# EAGLE design esprelayboard (EAGLE 9.6.2)
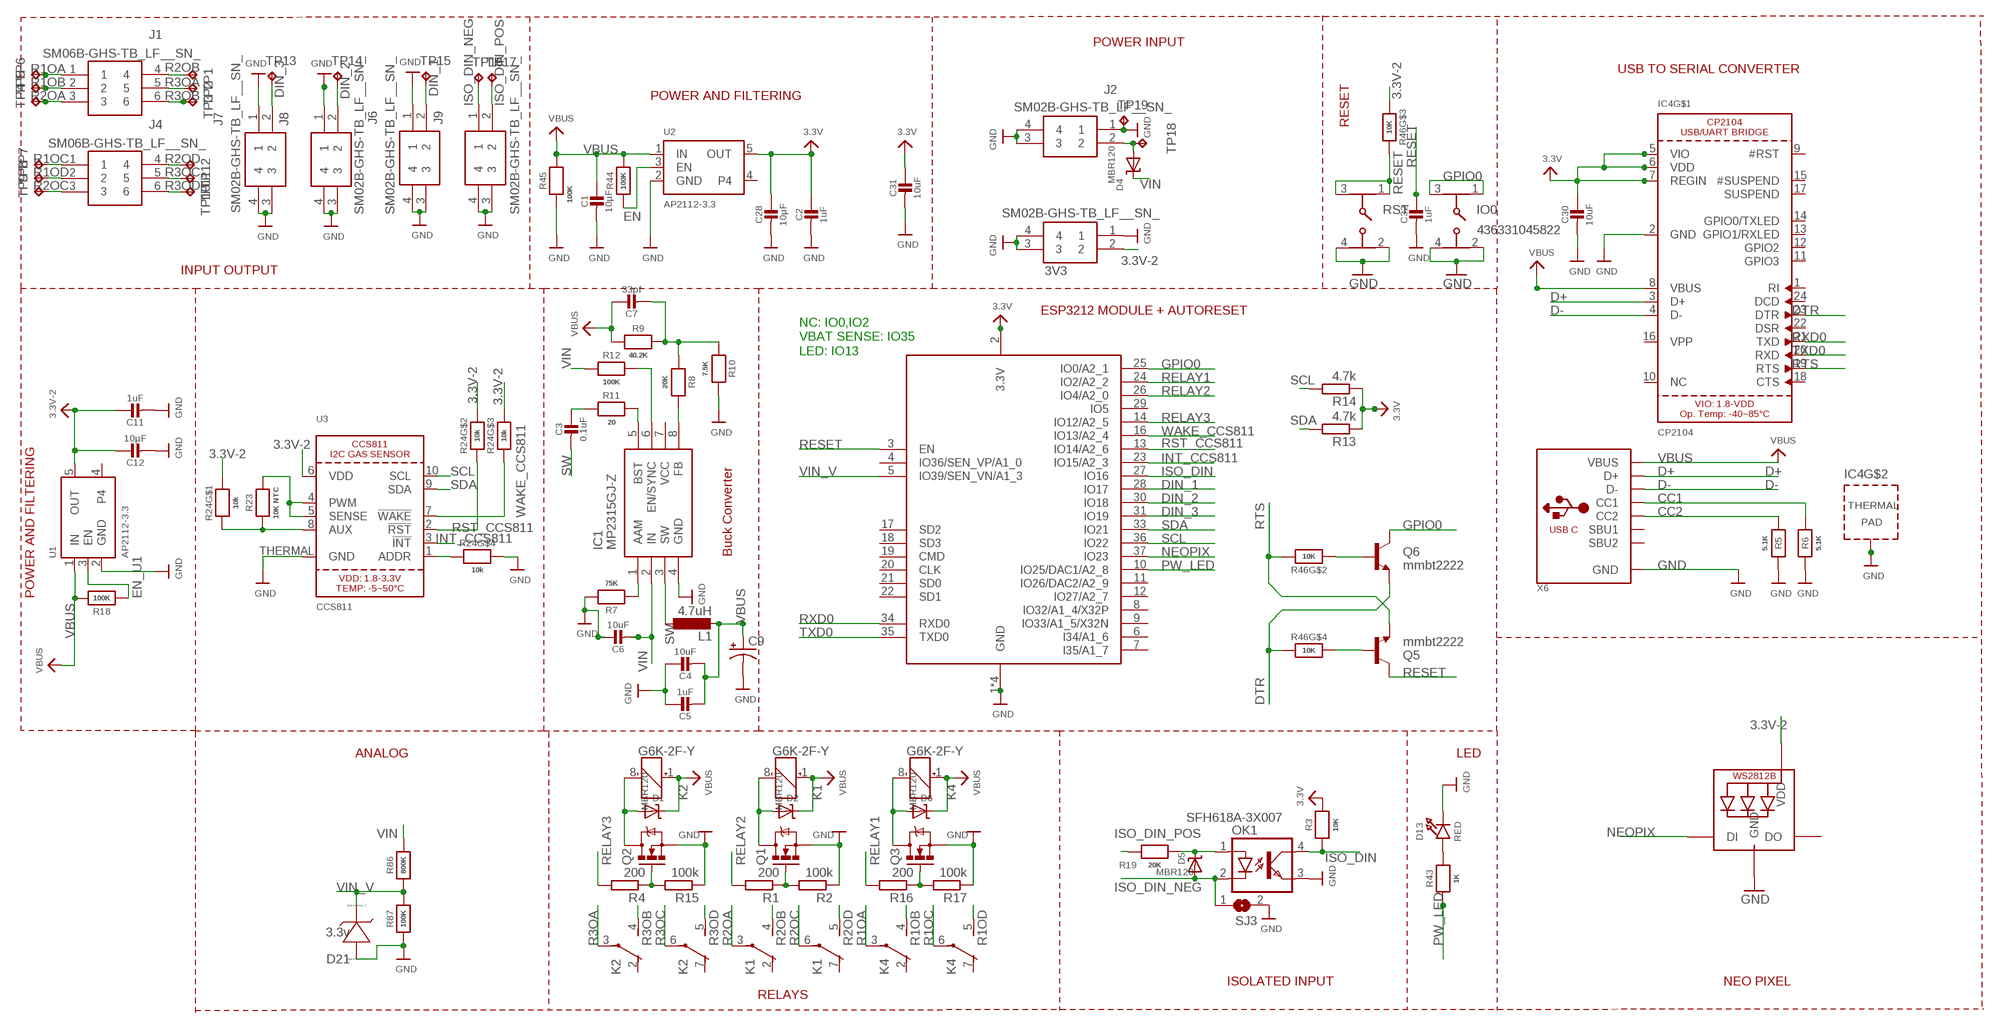
[diagram p0: schematic, sheet 1]

## Parts
3V3  SM02B-GHS-TB_LF__SN_  [SM02BGHSTBLFSN]
C1  10µF  CAP_CERAMIC0805-NOOUTLINE  [0805-NO]
C2  1uF  CAP_CERAMIC0603_NO  [0603-NO@1]
C3  0.1uF  CAP_CERAMIC0603_NO  [0603-NO@1]
C4  10uF  CAP_CERAMIC0603_NO  [0603-NO@1]
C5  1uF  CAP_CERAMIC0603_NO  [0603-NO@1]
C6  10uF  CAP_CERAMIC0603_NO  [0603-NO@1]
C7  33pf  CAP_CERAMIC0603_NO  [0603-NO@1]
C9  CPOL-USUD-6,3X5,8  [UD-6,3X5,8_NICHICON]
C11  1uF  CAP_CERAMIC0603_NO  [0603-NO@1]
C12  10µF  CAP_CERAMIC0805-NOOUTLINE  [0805-NO]
C28  10µF  CAP_CERAMIC0805-NOOUTLINE  [0805-NO]
C30  10uF  CAP_CERAMIC0805-NOOUTLINE  [0805-NO]
C31  10uF  CAP_CERAMIC0805-NOOUTLINE  [0805-NO]
C32  1uF  CAP_CERAMIC0603_NO  [0603-NO@1]
D1  MBR120  DIODE-SCHOTTKYSOD-123  [SOD-123]
D2  MBR120  DIODE-SCHOTTKYSOD-123  [SOD-123]
D4  MBR120  DIODE-SCHOTTKYSOD-123  [SOD-123]
D5  MBR120  DIODE-SCHOTTKYSOD-123  [SOD-123]
D6  MBR120  DIODE-SCHOTTKYSOD-123  [SOD-123]
D13  RED  LED0805_NOOUTLINE  [CHIPLED_0805_NOOUTLINE]
D21  3.3v  ZENER  [SOD123]
IC1  MP2315GJ-Z  [SOT65P280X100-8N]
IC4  CP2104  [QFN24_4MM_SMSC]
IO0  436331045822  [436331045822]
J1  SM06B-GHS-TB_LF__SN_  [SM06B-GHS-TB]
J2  SM02B-GHS-TB_LF__SN_  [SM02BGHSTBLFSN]
J4  SM06B-GHS-TB_LF__SN_  [SM06B-GHS-TB]
J6  SM02B-GHS-TB_LF__SN_  [SM02BGHSTBLFSN]
J7  SM02B-GHS-TB_LF__SN_  [SM02BGHSTBLFSN]
J8  SM02B-GHS-TB_LF__SN_  [SM02BGHSTBLFSN]
J9  SM02B-GHS-TB_LF__SN_  [SM02BGHSTBLFSN]
K1  G6K-2F-Y  [G6K-2F-Y]
K2  G6K-2F-Y  [G6K-2F-Y]
K4  G6K-2F-Y  [G6K-2F-Y]
L1  4.7uH  L-EUL2825P  [L2825P]
LED1  WS2812B3535  [LED3535]
OK1  SFH618A-3X007  [SMD4-7]
Q1  MOSFET-NCHANNELAO3404A  [SOT23-3]
Q2  MOSFET-NCHANNELAO3404A  [SOT23-3]
Q3  MOSFET-NCHANNELAO3404A  [SOT23-3]
Q5  mmbt2222  TRANSISTOR_NPNSOT23-3  [SOT23-3]
Q6  mmbt2222  TRANSISTOR_NPNSOT23-3  [SOT23-3]
R1  200  R-EU_R0603  [R0603]
R2  100k  R-EU_R0603  [R0603]
R3  10K  RESISTOR_0603_NOOUT  [0603-NO]
R4  200  R-EU_R0603  [R0603]
R5  5.1K  RESISTOR_0603_NOOUT  [0603-NO]
R6  5.1K  RESISTOR_0603_NOOUT  [0603-NO]
R7  75K  RESISTOR_0603_NOOUT  [0603-NO]
R8  20K  RESISTOR_0603_NOOUT  [0603-NO]
R9  40.2K  RESISTOR_0603_NOOUT  [0603-NO]
R10  7.5K  RESISTOR_0603_NOOUT  [0603-NO]
R11  20  RESISTOR_0603_NOOUT  [0603-NO]
R12  100K  RESISTOR_0603_NOOUT  [0603-NO]
R13  4.7k  R-EU_R0603  [R0603]
R14  4.7k  R-EU_R0603  [R0603]
R15  100k  R-EU_R0603  [R0603]
R16  200  R-EU_R0603  [R0603]
R17  100k  R-EU_R0603  [R0603]
R18  100K  RESISTOR_0603_NOOUT  [0603-NO]
R19  20K  RESISTOR_0603_NOOUT  [0603-NO]
R23  10K NTC  RESISTOR_0402  [_0402]
R24  10k  RESISTOR_4PACK  [RESPACK_4X0603]
R43  1K  RESISTOR_0603_NOOUT  [0603-NO]
R44  100K  RESISTOR_0603_NOOUT  [0603-NO]
R45  100K  RESISTOR_0603_NOOUT  [0603-NO]
R46  10K  RESISTOR_4PACK  [RESPACK_4X0603]
R86  800K  RESISTOR_0603_NOOUT  [0603-NO]
R87  100K  RESISTOR_0603_NOOUT  [0603-NO]
RST  436331045822  [436331045822]
SJ3  SJ  [SJ]
TP1  TPTP14SQ  [TP14SQ]
TP2  TPTP14SQ  [TP14SQ]
TP3  TPTP14SQ  [TP14SQ]
TP4  TPTP14SQ  [TP14SQ]
TP5  TPTP14SQ  [TP14SQ]
TP6  TPTP14SQ  [TP14SQ]
TP7  TPTP14SQ  [TP14SQ]
TP8  TPTP14SQ  [TP14SQ]
TP9  TPTP14SQ  [TP14SQ]
TP10  TPTP14SQ  [TP14SQ]
TP11  TPTP14SQ  [TP14SQ]
TP12  TPTP14SQ  [TP14SQ]
TP13  TPTP14SQ  [TP14SQ]
TP14  TPTP14SQ  [TP14SQ]
TP15  TPTP14SQ  [TP14SQ]
TP16  TPTP14SQ  [TP14SQ]
TP17  TPTP14SQ  [TP14SQ]
TP18  TPTP14SQ  [TP14SQ]
TP19  TPTP14SQ  [TP14SQ]
U1  AP2112-3.3  VREG_SOT23-5  [SOT23-5]
U2  AP2112-3.3  VREG_SOT23-5  [SOT23-5]
U3  CCS811  [CCS811]
X6  USB_C  [USB_C_CUSB31-CFM2AX-01-X]
X8  ESP32_WROOM32_SKINNY  [WROOM32_SKINNY]

## Nets
3.3V: C2.1 C28.1 C31.1 R3.1 R13.1 R14.1 U2.5(OUT) X8.2(3.3V)
3.3V-2: 3V3.2 C11.1 C12.1 C30.1 IC4.5(VIO) IC4.6(VDD) IC4.7(REGIN) LED1.2(VDD) R24.6 R24.7 R24.8 R46.3 U1.5(OUT) U3.6(VDD) ; supply symbol labelled 3.3V
CC1: R6.2 X6.A5(CC1)
CC2: R5.2 X6.B5(CC2)
D+: IC4.3(D+) X6.A6(D+) X6.B6(D+)
D-: IC4.4(D-) X6.A7(D-) X6.B7(D-)
DIN_1: J6.2 TP15.TP X8.28(IO17)
DIN_2: J8.2 TP14.TP X8.30(IO18)
DIN_3: J7.2 TP13.TP X8.31(IO19)
DTR: IC4.23(DTR) Q6.2(E) R46.4
EN: R44.1 U2.3(EN)
EN_U1: R18.1 U1.3(EN)
GND: 3V3.1 3V3.3 3V3.4 C1.2 C2.2 C4.1 C5.1 C6.1 C9.- C11.2 C12.2 C28.2 C30.2 C31.2 C32.2 D13.C D21.A(+) IC1.4(GND) IC4.2(GND) IC4.THERM(TP) IO0.2 IO0.4 J2.1 J2.3 J2.4 J6.1 J6.3 J6.4 J7.1 J7.3 J7.4 J8.1 J8.3 J8.4 J9.3 J9.4 LED1.4(GND) OK1.3(EMIT) Q1.2(S) Q2.2(S) Q3.2(S) R2.1 R5.1 R6.1 R7.2 R10.2 R15.1 R17.1 R24.5 R45.1 R87.1 RST.2 RST.4 SJ3.2 TP19.TP U1.2(GND) U2.2(GND) U3.THERMAL(GND) X6.A1B12(GND) X6.B1A12(GND) X8.1(GND) X8.15(GND) X8.38(GND) X8.P$1(GND)
GPIO0: IO0.1 IO0.3 Q6.3(C) X8.25(IO0/A2_1)
INT_CCS811: U3.3(!INT) X8.23(IO15/A2_3)
ISO_DIN: OK1.4(COL) R3.2 X8.27(IO16)
ISO_DIN_NEG [high_v]: D5.A J9.1 OK1.2(C) SJ3.1 TP16.TP
ISO_DIN_POS [high_v]: J9.2 R19.2 TP17.TP
N$1: D13.A R43.2
N$2: Q1.1(G) R1.1 R2.2
N$3: D2.A K1.8(1:-) Q1.3(D)
N$4: D4.A J2.2 TP18.TP
N$5: Q2.1(G) R4.1 R15.2
N$6: Q3.1(G) R16.1 R17.2
N$7: D1.A K2.8(1:-) Q2.3(D)
N$8: D6.A K4.8(1:-) Q3.3(D)
N$9 [high_v]: D5.C OK1.1(A) R19.1
N$13: R23.2 U3.4(PWM) U3.5(SENSE)
N$14: R23.1 R24.1 U3.8(AUX)
N$15: R24.4 U3.1(ADDR)
N$20: IC1.8(FB) R8.2
N$21: C7.2 R8.1 R9.2 R10.1
N$22: IC1.5(BST) R11.2
N$23: IC1.1(AAM) R7.1
N$24: IC1.6(EN/SYNC) R12.2
N$25: C3.1 R11.1
N$45: Q5.1(B) R46.5
N$48: Q6.1(B) R46.2
NEOPIX: LED1.1(DI) X8.37(IO23)
PW_LED: R43.1 X8.10(IO25/DAC1/A2_8)
R1OA: J1.1 K4.3(2:P) TP6.TP
R1OB: J1.2 K4.4(2:S) TP5.TP
R1OC: J4.1 K4.6(3:P) TP7.TP
R1OD: J4.2 K4.5(3:S) TP8.TP
R2OA: J1.3 K1.3(2:P) TP4.TP
R2OB: J1.4 K1.4(2:S) TP1.TP
R2OC: J4.3 K1.6(3:P) TP9.TP
R2OD: J4.4 K1.5(3:S) TP12.TP
R3OA: J1.5 K2.3(2:P) TP2.TP
R3OB: J1.6 K2.4(2:S) TP3.TP
R3OC: J4.5 K2.6(3:P) TP11.TP
R3OD: J4.6 K2.5(3:S) TP10.TP
RELAY1: R16.2 X8.24(IO2/A2_2)
RELAY2: R1.2 X8.26(IO4/A2_0)
RELAY3: R4.2 X8.14(IO12/A2_5)
RESET: C32.1 Q5.3(C) R46.6 RST.1 RST.3 X8.3(EN)
RST_CCS811: R24.2 U3.2(!RST) X8.13(IO14/A2_6)
RTS: IC4.19(RTS) Q5.2(E) R46.7
RXD0: IC4.21(TXD) X8.34(RXD0)
SCL: R14.2 U3.10(SCL) X8.36(IO22)
SDA: R13.2 U3.9(SDA) X8.33(IO21)
SW: C3.2 IC1.3(SW) L1.1
TXD0: IC4.20(RXD) X8.35(TXD0)
VBUS: C1.1 C4.2 C5.2 C7.1 C9.+ D1.C D2.C D6.C IC4.8(VBUS) K1.1(1:+) K2.1(1:+) K4.1(1:+) L1.2 R9.1 R18.2 R44.2 R45.2 U1.1(IN) U2.1(IN) X6.A4B9(VBUS) X6.B4A9(VBUS)
VIN: C6.2 D4.C IC1.2(IN) R12.1 R86.2
VIN_V: D21.C(-) R86.1 R87.2 X8.5(IO39/SEN_VN/A1_3)
WAKE_CCS811: R24.3 U3.7(!WAKE) X8.16(IO13/A2_4)
Unconnected: IC1.7(VCC) IC4.1(RI) IC4.9(#RST) IC4.10(NC) IC4.11(GPIO3) IC4.12(GPIO2) IC4.13(GPIO1/RXLED) IC4.14(GPIO0/TXLED) IC4.15(#SUSPEND) IC4.16(VPP) IC4.17(SUSPEND) IC4.18(CTS) IC4.22(DSR) IC4.24(DCD) K1.2(2:O) K1.7(3:O) K2.2(2:O) K2.7(3:O) K4.2(2:O) K4.7(3:O) LED1.3(DO) R46.1 R46.8 U1.4 U2.4 X6.A8(SBU1) X6.B8(SBU2) X8.4(IO36/SEN_VP/A1_0) X8.6(I34/A1_6) X8.7(I35/A1_7) X8.8(IO32/A1_4/X32P) X8.9(IO33/A1_5/X32N) X8.11(IO26/DAC2/A2_9) X8.12(IO27/A2_7) X8.17(SD2) X8.18(SD3) X8.19(CMD) X8.20(CLK) X8.21(SD0) X8.22(SD1) X8.29(IO5)

## Notes on the sheet
- POWER INPUT
- USB TO SERIAL CONVERTER
- POWER AND FILTERING
- RESET
- INPUT OUTPUT
- ESP3212 MODULE + AUTORESET
- NC: IO0,IO2
  VBAT SENSE: IO35
  LED: IO13
- Buck Converter
- POWER AND FILTERING
- ANALOG | LED
- ISOLATED INPUT | NEO PIXEL
- RELAYS

## Library data of the parts
3V3 J2 J6-J9 = SM02B-GHS-TB_LF__SN_:SM02B-GHS-TB_LF__SN_: GH 1.25mm header side entry 2 way JST GH Series, 1.25mm Pitch 2 Way Shrouded Right Angle PCB Header, Surface Mount, Solder Termination Source: Datasheet <http://docs-emea.rs-online.com/webdocs/13ed/0900766b813ed075.pdf>; ARROW_PART_NUMBER: SM02B-GHS-TB(LF)(SN); ARROW_PRICE-STOCK: https://www.arrow.com/en/products/sm02b-ghs-tb-lf-sn/jst-manufacturing; DESCRIPTION: GH 1.25mm header side entry 2 way JST GH Series, 1.25mm Pitch 2 Way Shrouded Right Angle PCB Header, Surface Mount, Solder Termination; HEIGHT: 4.25mm; MANUFACTURER_NAME: JST (JAPAN SOLDERLESS TERMINALS); MANUFACTURER_PART_NUMBER: SM02B-GHS-TB(LF)(SN)
C1-C7 C11 C12 C28 C30-C32 = microbuilder:CAP_CERAMIC: Ceramic Capacitors For new designs, use the packages preceded by an '_' character since they are more reliable: The following footprints should be used on most boards: _0402 - Standard footprint for regular board layouts _0603 - Standard footprint for regular board layouts _0805 - Standard footprint for regular board layouts _1206 - Standard footprint for regular board layouts For extremely tight-pitch boards where space is at a premium, the following 'micro-pitch' footprints can be used (smaller pads, no silkscreen outline, etc.): _0402MP - Micro-pitch footprint for very dense/compact boards _0603MP - Micro-pitch footprint for very dense/compact boards _0805MP - Micro-pitch footprint for very dense/compact boards _1206MP - Micro-pitch footprint for very dense/compact boards
C9 = rcl:CPOL-US: POLARIZED CAPACITOR, American symbol; SPICEPREFIX: C
D1 D2 D4-D6 = microbuilder:DIODE-SCHOTTKY
D13 = microbuilder:LED: LED 0603 - 0603 Surface Mount Package 2mA: Green LED - Low Power (3.9mcd, 2ma, 1.7Vf) - Digikey: 475-2709-2-ND Orange LED - Low Power (9.8mcd, 2ma, 1.8Vf) - Digikey: 475-1194-2-ND Red LED - Low Power (5mcd, 2ma, 1.8Vf) - Digikey: 475-1195-2-ND Yellow LED - Low Power (7mcd, 2ma, 1.8Vf) - Digikey: 475-1196-2-ND 5mA: Blue LED - Low Power (17mcd, 5ma, 2.9Vf) - Digikey: LNJ937W8CRACT-ND 0805 - 0805 Surface Mount Package 2mA: Red LED (8.8mcd, 2mA, 1.8Vf, Clear) - Low Power [Digikey: 475-2510-1-ND] Green LED (5mcd, 2mA, 1.8Vf, Clear) - Low Power [Digikey: 475-2730-1-ND] Yellow LED (11.3mcd, 2mA, 1.8Vf, Clear) - Low Power [Digikey: 475-2555-1-ND] 20mA: Red LED (104mcd, 20mA, Diffused) - LS R976 [Digikey: 475-1278-6-ND] Red LED (12mcd, 20mA, 2.0Vf, Clear) - APT2012EC [Digikey: 754-1128-1-ND] Green LED (15mcd, 20mA, 2.2Vf, Clear) - APT2012GC [Digikey: 754-1131-1-ND] Orange LED (160mcd, 20mA, 2.1Vf, Clear) - APT2012SECK [Digikey: 754-1130-1-ND] 1206 - 1206 Surface Mount Package Green LED (26mcd, 20mA, Diffused) - LG N971 [Digikey: 475-1407-6-ND] Red LED (15mcd, 20mA, Diffused) - LH N974 [Digikey: 475-1416-6-ND] Cree - Cree High-Power Surface Mount LEDs XPEBWT-L1-0000-00D50 - White 111lm 350mA 2.9Vf 6200K 110° XTEAWT-00-0000-00000LEE3 - White 114lm 350mA 2.85Vf 5000K 115° Everlight - Everlight 45-21 Series Surface Mount LEDs 45-21/QK2C-B2832AC2CB2/2T - Warm White 2000mcd 20mA 3.25Vf 3050K 120° 45-21/LK2C-B38452C4CB2/2T - Nuetral White 2000mcd 20mA 3.25Vf 4150K 120° 45-21/LK2C-B50634C6CB2/2T - Cold White 2200mcd 20mA 3.25Vf 5650K 120° PLCC2 Reverse Mount LS T77K-J1L2-1-0-2-R18-Z - Red 11.25mcd 2mA 1.8Vf 630nm 120° LO T77K-L1M2-24-Z - Orange 19.6mcd 2mA 1.8Vf 606nm 120° LY T77K-K2M1-26-Z - Yellow 15.7mcd 2mA 1.8Vf 587nm 120°
D21 = sym:ZENER: Zener Diode
IC1 = MP2315GJ-Z:MP2315GJ-Z: Switching Voltage Regulators 3A 24V 500kHz Sync buck Source: Datasheet <https://componentsearchengine.com/Datasheets/1/MP2315GJ-Z.pdf>; DESCRIPTION: Switching Voltage Regulators 3A 24V 500kHz Sync buck; HEIGHT: 1mm; MANUFACTURER_NAME: Monolithic Power Systems (MPS); MANUFACTURER_PART_NUMBER: MP2315GJ-Z; MOUSER_PART_NUMBER: 946-MP2315GJZ; MOUSER_PRICE-STOCK: https://www.mouser.co.uk/ProductDetail/Monolithic-Power-Systems-MPS/MP2315GJ-Z?qs=QEkzKklKf2QEN5VKd%252Br2GQ%3D%3D
IC4 = microbuilder:CP2104: CP2104 - USB to UART Bridge VDD Output: 3.45V
IO0 RST = 436331045822:436331045822: 3.5x4.7 mm SMD J-Bend side push, boss design WS-TASU <http://katalog.we-online.de/media/images/v2/Family_WS_TUS_Normal_SMD_J-Bend_4363x10458xx_pf2.jpg> Details see: http://katalog.we-online.de/em/datasheet/4363x10458xx.pdf 2015 (C) Wurth Elektronik; AVAILABILITY: Unavailable; DESCRIPTION: Tactile Switch SPST-NO Side Actuated Surface Mount, Right Angle; DIGIKEY-PURCHASE-URL: https://snapeda.com/shop?store=DigiKey&id=3209049; MF: Wurth Electronics; MOUSER-PURCHASE-URL: https://snapeda.com/shop?store=Mouser&id=3209049; MP: 436331045822; PACKAGE: None; PRICE: None
J1 J4 = SM06B-GHS-TB_LF__SN_:SM06B-GHS-TB_LF__SN_: GH 1.25mm header side entry 6 way JST GH Series, 1.25mm Pitch 6 Way Right Angle PCB Header, Solder Termination, 1A Source: Datasheet <http://docs-emea.rs-online.com/webdocs/13ed/0900766b813ed077.pdf>; ARROW_PART_NUMBER: SM06B-GHS-TB(LF)(SN); ARROW_PRICE-STOCK: https://www.arrow.com/en/products/sm06b-ghs-tb-lf-sn/jst-manufacturing; DESCRIPTION: GH 1.25mm header side entry 6 way JST GH Series, 1.25mm Pitch 6 Way Right Angle PCB Header, Solder Termination, 1A; HEIGHT: mm; MANUFACTURER_NAME: JST (JAPAN SOLDERLESS TERMINALS); MANUFACTURER_PART_NUMBER: SM06B-GHS-TB(LF)(SN)
K1 K2 K4 = relay:G6K: Low Signal Relay oeiwcsnts1.omron.com/.. D20G6K0100.pdf; MF: OMRON COMPONENTS USA; MPN: G6K-2F-Y DC3; OC_FARNELL: 1690316; OC_NEWARK: 89C6451
L1 = rcl:L-EU: INDUCTOR, European symbol; SPICEPREFIX: L
LED1 = microbuilder:WS2812B
OK1 = optocoupler:SFH618?*: Optocoupler, Phototransistor Output, Low Input Current Source: Data sheet <http://www.vishay.com/docs/83673/sfh618.pdf>; OC_FARNELL: unknown; OC_NEWARK: unknown
Q1-Q3 = SparkFun-DiscreteSemi:MOSFET-NCHANNEL: Common NMOSFET Parts MFG P/N Store ID Prod ID FDD8780 TRANS-09984 SI7820DN TRANS-11055 FDS6630A IC-08089 2N7002PW TRANS-11151 FQP30N06L COM-10213 TRANS-10060 BSS123LT1G TRANS-08345 BSS138 TRANS-00830 BS170 2N7000; PROD_ID: TRAN-12988
Q5 Q6 = SparkFun:TRANSISTOR_NPN: Transistor NPN BJT configuration in SOT23 package. MMBT2222 is the common NPN we use. Double check BCE configuration again layout.
R1 R2 R4 R13-R17 = resistor:R-EU_: RESISTOR, European symbol
R3 R5-R12 R18 R19 R23 R43-R45 R86 R87 = microbuilder:RESISTOR: Resistors For new designs, use the packages preceded by an '_' character since they are more reliable: The following footprints should be used on most boards: _0402 - Standard footprint for regular board layouts _0603 - Standard footprint for regular board layouts _0805 - Standard footprint for regular board layouts _1206 - Standard footprint for regular board layouts For extremely tight-pitch boards where space is at a premium, the following 'micro-pitch' footprints can be used (smaller pads, no silkscreen outline, etc.): _0402MP - Micro-pitch footprint for very dense/compact boards _0603MP - Micro-pitch footprint for very dense/compact boards _0805MP - Micro-pitch footprint for very dense/compact boards _1206MP - Micro-pitch footprint for very dense/compact boards
R24 R46 = microbuilder:RESISTOR_4PACK: Resistor Packs (4 resistors) 4 x 0603 10K 1/16W - Digikey: YC164J-10KCT-ND
SJ3 = jumper:SJ: SMD solder JUMPER
TP1-TP19 = testpad:TP: Test pad
U1 U2 = microbuilder:VREG_SOT23-5: SOT23-5 Fixed Voltage Regulators Part Current Out V Out V In V Dropout θJA (°C/W) TJ (°C) Digikey Part No. ADP121 150mA 3.3V 3.4-5.5V 0.09V @ 150mA -- -- ADP121-AUJZ33R7CT-ND ADP121 150mA 3.0V 3.1-5.5V 0.09V @ 150mA -- -- ADP121-AUJZ30R7CT-ND ADP122 300mA 3.3V 3.4-5.5V 0.085V @ 300mA -- -- ADP122AUJZ-3.3-R7CT-ND ADP1712 300mA 3.3V 3.5-5.5V 0.17V @ 300mA -- -- ADP1712AUJZ-3.3-R7TR-ND AP7311 (Low Cost) 150mA 3.3V 3.5-6V 0.15V @ 150mA -- -- AP7311-33WG-7DICT-ND LD39015M18R 150mA 1.8V 1.9V-5.5V 0.08V @ 100mA -- -- 497-6977-1-ND LP2985A-33DBVR 150mA 3.3V 3.3-16V 0.28V @ 150mA 206 150 296-18479-1-ND MCP1824T-3302E/OT 300mA 3.3V 3.5V-6V 0.2V @ 300mA -- -- MCP1824T-3302E/OTCT-ND MIC5205-2.5YM5 TR 150mA 2.5V 2.7-16V 0.165V @ 150mA -- -- 576-1257-2-ND MIC5205-3.0YM5 TR 150mA 3.0V 3.2V-16V 0.165V @ 150mA -- -- 576-1258-2-ND MIC5205-3.3YM5 TR 150mA 3.3V 3.5V-16V 0.165V @ 150mA -- -- 576-1259-2-ND TPS780330220 150mA 3.3V+2.2V 3.6-5.5V 250mV Max -- -- 296-23332-1-ND TDA3663/N1,135 100mA 3.3V 3.5-45V 0.18V @ 50mA -- -- 568-5343-1-ND Max operating temp can be calculated using θJA, TJ (max junction temperature), and power in watts. Set the "Maximum Ambient Temperature" until it reaches TJ ("Max Junction Temperature"), which is the absolute limit for safe use of the regulator: Heat Sink Temperature Calculator <http://www.daycounter.com/Calculators/Heat-Sink-Temperature-Calculator.phtml> For example, With 12V source into a 3.3V LP2985 and a 30mA load, we are dissipating (12V-3.3V) * 0.03A = 0.261W. With a θJA of 206 °C/W, a TJ of 150°C, and 261mW we can safely use the chip without a heat sink up to 75°C (=147.1°C Junction Temperature).
U3 = microbuilder:CCS811: CCS811 - I2C Gas and Air Quality Sensor
X6 = microbuilder:USB_C: USB Type-C USB 2.0 Connector
X8 = microbuilder:ESP32_WROOM32

## Net classes
1 power: width 0.305 mm
2 gnd: width 0.254 mm, clearance 0.203 mm
3 high_v: clearance 0.254 mm

## Board
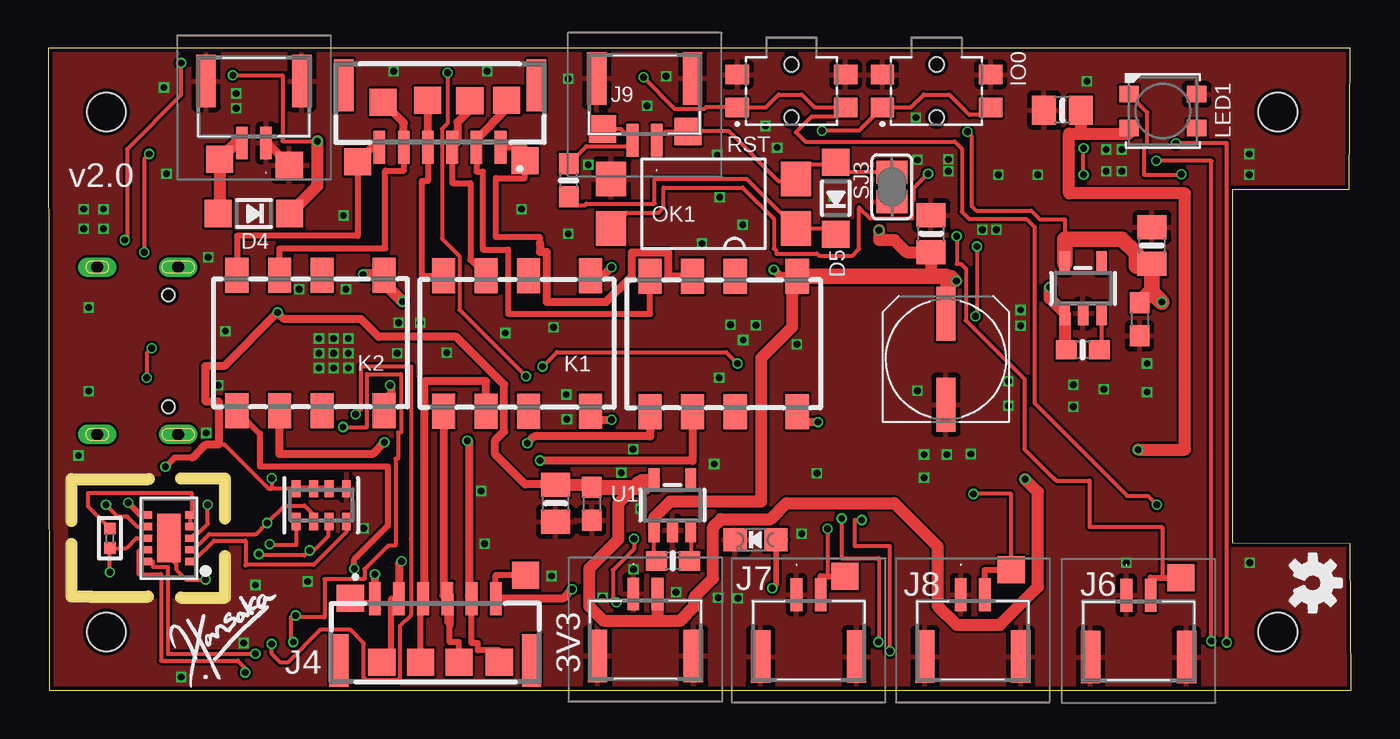
[diagram p1: board, top side]
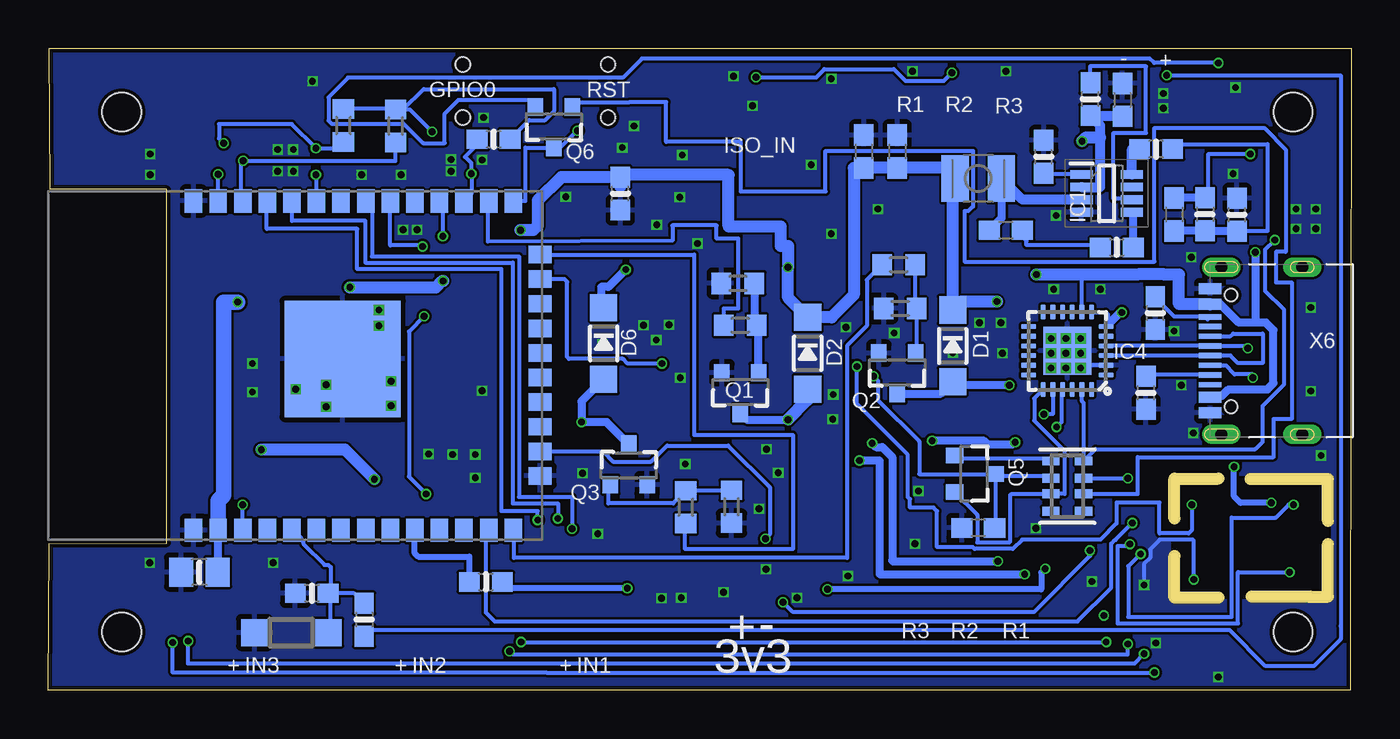
[diagram p2: board, bottom side, seen from below]

Size 67.28 x 33.14 mm. Coordinates in mm from the lower left corner, seen from the top.
Outline: 0.05,0 67.29,0 67.23,7.57 61.16,7.59 61.16,25.86 67.18,25.86 67.23,33.14 0,33.14 0.05,0
Copper layers (1*16): Top 0.035559375mm / dielectric 1.6mm / Bottom 0.035559375mm
Design rules "jlcpcb2layer": minimum track width 5mil, minimum drill 12mil, track to track 5mil, track to pad 5mil, pad to pad 5mil, via to via 5mil, smd to smd 5mil, copper to edge 8mil, drill to drill 6mil, minimum pad ring 5mil, minimum via ring 3mil, stop-mask expansion 2.5mil, vias tented up to drill 0mil, thermal gap 10mil
Holes 2 mm at 63.5,29.86 3,3 63.5,3 3,29.86
Milling: 9 lines

### Footprints (pad centres in the part's own frame; a part is rotated, then mirrored left to right if it is on the bottom)
SM02BGHSTBLFSN = smd 0.6 x 1.7: 1 -0.625,1.845; 2 0.625,1.845 | smd 1 x 2.7: 3 2.475,-1.355; 4 -2.475,-1.355
0805-NO = smd 1.24 x 1.5: 1 -0.95,0; 2 0.95,0
0603-NO@1 = smd 1.1 x 1: 1 -0.85,0; 2 0.85,0
UD-6,3X5,8_NICHICON = smd 2.8 x 1: + 2.35,0; - -2.35,0
SOD-123 = smd 1.4 x 1.4: A 1.85,0; C -1.85,0
CHIPLED_0805_NOOUTLINE = smd 1.2 x 1.2: A 0,-1.05; C 0,1.05
SOD123 = smd 1.4 x 1.4: A 1.9,0; C -1.9,0
SOT65P280X100-8N = smd 1.15 x 0.45: 1 -1.3,0.975; 2 -1.3,0.325; 3 -1.3,-0.325; 4 -1.3,-0.975; 5 1.3,-0.975; 6 1.3,-0.325; 7 1.3,0.325; 8 1.3,0.975
QFN24_4MM_SMSC = smd 0.8 x 0.28: 1 -2,1.25; 2 -2,0.75; 3 -2,0.25; 4 -2,-0.25; 5 -2,-0.75; 6 -2,-1.25; 13 2,-1.25; 14 2,-0.75; 15 2,-0.25; 16 2,0.25; 17 2,0.75; 18 2,1.25 | smd 0.28 x 0.8: 7 -1.25,-2; 8 -0.75,-2; 9 -0.25,-2; 10 0.25,-2; 11 0.75,-2; 12 1.25,-2; 19 1.25,2; 20 0.75,2; 21 0.25,2; 22 -0.25,2; 23 -0.75,2; 24 -1.25,2 | smd 2.5 x 2.5: THERM 0,0
436331045822 = smd 1.2 x 1: 1 2.8,0.85; 2 2.8,-0.85; 3 -2.8,0.85; 4 -2.8,-0.85 | hole 0.75: 0,1.375; 0,-1.375
SM06B-GHS-TB = smd 0.6 x 1.7: 1 2.25,4.3; 2 3.5,4.3; 3 4.75,4.3; 4 6,4.3; 5 7.25,4.3; 6 8.5,4.3 | smd 1 x 2.7: 7 0.4,1.1; 8 10.35,1.1
G6K-2F-Y = smd 1.2 x 1.8: 1 -3.8,-3.5; 2 -0.6,-3.5; 3 1.6,-3.5; 4 3.8,-3.5; 5 3.8,3.5; 6 1.6,3.5; 7 -0.6,3.5; 8 -3.8,3.5
L2825P = smd 1.4 x 2.4: 1 -1.2,0; 2 1.2,0
LED3535 = smd 1 x 0.85: 1 -1.75,0.875; 2 -1.75,-0.875; 3 1.75,-0.875; 4 1.75,0.875
SMD4-7 = smd 1.78 x 1.55: 1 -1.27,-4.77; 2 1.27,-4.77; 3 1.27,4.77; 4 -1.27,4.77
SOT23-3 = smd 0.8 x 0.9: 1 -0.95,-1; 2 0.95,-1; 3 0,1.1
R0603 = smd 1 x 1.1: 1 -0.85,0; 2 0.85,0
0603-NO = smd 1.075 x 1: 1 -0.85,0; 2 0.85,0
_0402 = smd 0.6 x 0.6: 1 -0.508,0; 2 0.508,0
RESPACK_4X0603 = smd 0.45 x 0.9: 1 -1.3,-0.85; 2 -0.4,-0.85; 3 0.4,-0.85; 4 1.3,-0.85; 5 1.3,0.85; 6 0.4,0.85; 7 -0.4,0.85; 8 -1.3,0.85
SJ = smd 1.168 x 1.6: 1 -0.762,0; 2 0.762,0
TP14SQ = smd 1.4 x 1.4: TP 0,0
SOT23-5 = smd 0.55 x 1.2: 1 -0.95,-1.3; 2 0,-1.3; 3 0.95,-1.3; 4 0.95,1.3; 5 -0.95,1.3
CCS811 = smd 0.5 x 0.375: 1 -1.1,1.2; 2 -1.1,0.6; 3 -1.1,0; 4 -1.1,-0.6; 5 -1.1,-1.2; 6 1.1,-1.2; 7 1.1,-0.6; 8 1.1,0; 9 1.1,0.6; 10 1.1,1.2 | smd 1.2 x 2.5: THERMAL 0,0
USB_C_CUSB31-CFM2AX-01-X = smd 0.575 x 1.15: A1B12 -3.2,3.545; A4B9 -2.4,3.545; B1A12 3.2,3.545; B4A9 2.4,3.545 | smd 0.275 x 1.15: A5 -1.25,3.545; A6 -0.25,3.545; A7 0.25,3.545; A8 1.25,3.545; B5 1.75,3.545; B6 0.75,3.545; B7 -0.75,3.545; B8 -1.75,3.545 | drill 0.6 pad 1 long: M1 -4.32,2.97; M2 4.32,2.97; M3 -4.32,-1.21; M4 4.32,-1.21 | hole 0.65: 2.89,2.47; -2.89,2.47
WROOM32_SKINNY = smd 1.2 x 0.9: 1 -8.5,5; 2 -8.5,3.73; 3 -8.5,2.46; 4 -8.5,1.19; 5 -8.5,-0.08; 6 -8.5,-1.35; 7 -8.5,-2.62; 8 -8.5,-3.89; 9 -8.5,-5.16; 10 -8.5,-6.43; 11 -8.5,-7.7; 12 -8.5,-8.97; 13 -8.5,-10.24; 14 -8.5,-11.51; 25 8.5,-11.51; 26 8.5,-10.24; 27 8.5,-8.97; 28 8.5,-7.7; 29 8.5,-6.43; 30 8.5,-5.16; 31 8.5,-3.89; 32 8.5,-2.62; 33 8.5,-1.35; 34 8.5,-0.08; 35 8.5,1.19; 36 8.5,2.46; 37 8.5,3.73; 38 8.5,5 | smd 0.9 x 1.2: 15 -5.7,-12.9; 16 -4.43,-12.9; 17 -3.16,-12.9; 18 -1.89,-12.9; 19 -0.62,-12.9; 20 0.65,-12.9; 21 1.92,-12.9; 22 3.19,-12.9; 23 4.46,-12.9; 24 5.73,-12.9 | smd 6 x 6: P$1 0.34,-2.7

### Placement (x,y rotation side)
3V3  30.84,3.12 0 top
C1  45.59,23.57 90 top
C2  56.36,19.15 270 top
C3  17.83,23.75 180 bottom
C4  23.44,27.81 270 bottom
C5  25.17,27.81 270 bottom
C6  11.81,30.48 270 bottom
C7  9.14,24.56 270 bottom
C9  46.35,17.09 90 top
C11  28.07,9.63 270 top
C12  26.19,9.65 270 top
C28  57,22.96 90 top
C30  52.37,29.95 180 top
C31  59.49,6.1 180 bottom
C32  19.25,8.38 180 bottom
D1  20.57,17.78 270 bottom
D2  28.07,17.4 270 bottom
D4  10.62,24.61 180 top
D5  40.67,25.4 90 top
D6  38.61,17.91 270 bottom
D13  36.53,7.77 90 top
D21  54.74,2.97 180 bottom
IC1  12.62,25.65 0 bottom
IC4  14.66,17.53 180 bottom
IO0  45.87,30.94 180 top
J1  25.6,32.33 180 top
J2  10.62,30.1 180 top
J4  14.61,0.43 0 top
J6  56.3,3.07 0 top
J7  39.26,3.09 0 top
J8  47.74,3.09 0 top
J9  30.79,30.23 180 top
K1  24.21,17.91 180 top
K2  13.54,17.93 180 top
K4  34.87,17.88 180 top
L1  19.25,26.42 180 bottom
LED1  57.56,29.9 0 top
OK1  33.83,25.12 90 top
Q1  31.55,15.39 180 bottom
Q2  23.44,16.41 180 bottom
Q3  37.31,11.61 0 bottom
Q5  19.48,11.18 270 bottom
Q6  41.17,29.11 180 bottom
R1  31.55,18.85 180 bottom
R2  31.67,21.01 0 bottom
R3  44.29,28.45 180 bottom
R4  23.37,21.97 180 bottom
R5  10.11,19.47 90 bottom
R6  10.59,15.36 90 bottom
R7  15.88,27.55 90 bottom
R8  10.07,27.94 180 bottom
R9  7.54,24.57 270 bottom
R10  5.89,24.55 90 bottom
R11  12.1,22.86 0 bottom
R12  13.46,30.52 90 bottom
R13  52.04,29.16 270 bottom
R14  49.35,29.13 270 bottom
R15  23.29,19.71 0 bottom
R16  34.37,9.45 270 bottom
R17  32,9.47 90 bottom
R18  32.26,6.68 180 top
R19  26.87,26.33 90 top
R23  3.17,7.85 90 top
R24  14.1,9.55 0 top
R43  44.69,5.59 0 bottom
R44  53.43,17.58 180 top
R45  37.74,25.64 90 bottom
R46  14.66,10.54 90 bottom
R86  50.98,3.64 270 bottom
R87  53.68,5 0 bottom
RST  38.38,30.94 180 top
SJ3  43.56,25.98 270 top
TP1  19.58,30.45 0 top
TP2  17.3,30.35 0 top
TP3  15.98,27.28 0 top
TP4  21.77,30.43 0 top
TP5  23.67,30.45 0 top
TP6  24.61,27.33 0 top
TP7  15.6,4.75 0 top
TP8  17.22,1.45 0 top
TP9  19.23,1.45 0 top
TP10  24.64,5.94 0 top
TP11  23.29,1.45 0 top
TP12  21.21,1.45 0 top
TP13  41.14,5.89 0 top
TP14  49.73,6.22 0 top
TP15  58.49,5.81 0 top
TP16  33.04,28.85 0 top
TP17  28.62,28.98 0 top
TP18  8.84,27.41 0 top
TP19  12.45,27.1 0 top
U1  32.23,9.55 0 top
U2  53.44,20.75 0 top
U3  6.22,7.85 180 top
U$38  [SIGNATURE]  6.15,-1.04 0 top
U$39  [OSHW-LOGO-S]  65.3,5.54 270 top
X6  3.73,17.53 90 bottom
X8  54.79,16.76 90 bottom

### Tracks (layer width: path | path; a pad name or v marks a point on that pad's centre or on a via)
3.3V  (via drill 0.35)
  Top 0.203: v47.47,28.83 47.68,28.63 47.68,25.02 47.93,24.77 50.76,24.77 51.22,24.31 52.5,24.31 52.5,23.3 52.49,23.29
  Top 0.813: U2.5 52.49,23.29 55.45,23.29 56.18,22.55 56.18,21.89 56.88,21.89 C28.1 57,20.55 | v57.51,20.04 57,20.55 | C2.1 56.91,20.55 57,20.55
  Bottom 0.203: R14.1 49.35,30.01 R13.1 | R3.1 42.45,29.43 41.63,29.43 41.17,29.89 41.17,31.04 47.9,31.04 48.96,29.98 R14.1 | R14.1 48.63,29.98 v47.47,28.83
  Bottom 0.406: C31.1 58.52,6.1 X8.2
  Bottom 0.813: X8.2 58.52,9.79 58.24,10.07 58.24,20.04 v57.51,20.04
3.3V-2  (via drill 0.35)
  Top 0.203: R24.8 11.48,10.4 | 11.48,10.4 11.38,10.4 9.1,12.67 8.79,12.67 | v11.53,10.94 11.53,10.45 11.48,10.4 | 7.88,12.45 7.88,12.44
  Top 0.305: R24.6 R24.7 R24.8 | U3.6 4.74,9.05 v4.12,9.68 | v6.04,11.54 6.52,12.01 7.45,12.01
  Top 0.406: U1.5 30.41,10.85 30.19,10.63 24.62,10.63 23.08,12.18 23.08,12.91 23.54,13.37 23.54,15.78 21.06,18.25 17.06,18.25 16.15,19.16 12.18,19.16 v11.84,19.51 9.07,16.74 8.1,16.74 8.1,14.94 8.13,14.91 8.79,14.91 8.79,12.67 8.1,12.67 7.88,12.44 7.45,12.01
  Top 0.61: C12.1 27.94,10.6 C11.1 28.16,10.39 30.82,10.39 U1.5 30.65,10.85 29.43,9.63 29.43,7.78 27.93,6.28 27.93,4.33 28.67,3.6 31.47,3.6 | 31.47,3.6 32.65,3.6 33.38,4.33 33.38,4.83 34.33,5.77 34.33,8.44 34.73,8.84 37.31,8.84 38.13,9.66 43.7,9.66 45.93,7.43 45.93,4.37 46.92,3.38 49.15,3.38 51.11,5.34 51.11,10.23 v50.44,10.9 | LED1.2 55.81,28.74 53.32,28.74 | 53.32,28.74 52.71,28.74 52.71,25.66 58.7,25.66 58.7,12.42 v56.29,12.42 | C30.1 53.32,28.74 | 3V3.2 31.46,3.61 31.47,3.6
  Bottom 0.203: IC4.5 IC4.6 12.57,18.86 12.57,19.43 12.67,19.53 IC4.7 | R46.3 v11.53,10.94
  Bottom 0.305: v4.12,9.68 5.71,9.68 6.04,10.01 v6.04,11.54
  Bottom 0.406: v11.84,19.51 11.92,19.51 12.57,18.86
  Bottom 0.61: v50.44,10.9 51.97,12.42 v56.29,12.42
CC1
  Bottom 0.203: X6.A5 10.52,16.28 R6.2
CC2
  Bottom 0.203: X6.B5 7.37,19.18 | 7.37,19.18 7.41,19.15 | R5.2 10.11,20.27 9.14,19.3 7.49,19.3 7.37,19.18
D+
  Bottom 0.203: IC4.3 X6.A6 6.23,17.28 5.84,16.89 4.57,16.89 4.57,18.41 6.1,18.41 6.23,18.28 X6.B6
D-  (via drill 0.35)
  Top 0.203: v5.33,17.65 5.08,17.4 v5.08,16.13
  Bottom 0.203: IC4.4 X6.A7 5.46,17.78 v5.33,17.65 | v5.08,16.13 5.08,16.31 6.02,16.31 6.48,16.77 7.27,16.77 X6.B7
DIN_1  (via drill 0.35)
  Top 0.203: v46.91,23.44 46.91,22.02 47.13,22.02 47.39,21.76 47.39,19.1 50.42,16.07 50.42,12.44 51.97,10.89 51.97,10.92 52.07,10.82 53.77,10.82 53.77,8.43 57.51,8.43 57.53,8.41 57.53,5.81
  Top 0.305: J6.2 56.93,5.81 57.53,5.81 TP15.TP
  Bottom 0.203: X8.28 46.91,25.26 v46.91,23.44
DIN_2  (via drill 0.35)
  Top 0.203: TP14.TP 49.73,10.13 v47.78,10.13 | v47.88,19.3 47.95,19.38 v47.95,22.91
  Top 0.305: J8.2 48.37,6.22 TP14.TP
  Bottom 0.203: v47.88,19.3 48.67,18.52 48.67,11.02 v47.78,10.13 | v47.95,22.91 47.95,22.96 49.63,22.96 X8.30
DIN_3  (via drill 0.35)
  Top 0.203: v40.23,8.33 40.23,5.89 41.1,5.89
  Top 0.305: J7.2 39.89,5.89 41.1,5.89 TP13.TP
  Bottom 0.203: X8.31 50.57,25.26 50.57,22.4 42.98,22.4 42.98,9.98 40.23,9.98 v40.23,8.33
DTR  (via drill 0.35)
  Top 0.203: v6.86,32.38 6.86,30.73 4.06,27.94 4.06,23.37 v3.94,23.24
  Bottom 0.203: IC4.23 13.91,14.92 13.81,14.82 R46.4 13.2,12.45 4.95,12.45 4.57,12.83 4.57,14.68 3.45,15.8 3.45,19.64 4.45,20.63 4.45,22.73 v3.94,23.24 | v6.86,32.38 10.18,32.38 10.4,32.61 36.63,32.61 37.62,31.62 51.8,31.62 52.82,30.6 52.82,29.41 52.66,29.25 48.94,29.25 47.93,28.25 46.81,28.25 46.81,29.77 46.1,30.48 42.49,30.48 Q6.2
EN
  Top 0.203: U2.3 54.39,17.69 R44.1
EN_U1
  Top 0.203: U1.3 33.18,6.75 R18.1
GND  (via drill 0.35)
  Top 0.203: U3.THERMAL 6.22,6.89 6.6,6.51 6.6,6.22 7.11,5.71 v8.13,5.71
  Top 0.406: TP19.TP 11.29,28.25 J2.1
  Bottom 0.203: IC4.2 13.91,16.78 IC4.THERM | v8.13,5.71 8.13,7.72 8.18,7.77 9.88,7.77 10.38,7.27 10.38,6.83 10.69,6.52 v10.69,5.44
  other vias: 13.97,18.16 14.73,18.16 13.97,17.4 13.97,16.64 14.73,17.4 14.73,16.64 15.49,18.16 15.49,17.4 15.49,16.64 2.08,15.44 2.08,19.76 24.43,24.84 22.66,31.95 17.83,31.95 62.03,26.62 50.22,19.63 49.58,14.68 34.59,4.78 38.91,8.08 34.39,11.68 53.64,31.45 54.64,26.8 49.07,26.62 30.91,30.18 26.77,14 62.05,6.58 49.58,15.95 44.88,15.47 35.23,18.87 1.83,23.83 2.84,23.83 1.83,24.84 2.84,24.84 26.09,18.75 19.2,18.97 1.55,12.12 15.37,20.7 8.25,22.35 22.53,7.57 13.39,5.61 26.85,31.57 25.98,5.89 9.14,18.54 15.24,24.51 6.1,26.67 34.67,25.45 9.7,30.81 9.7,30.05 8.76,15.75 38.66,17.86 39.7,11.2 51.1,26.62 33.76,23.06 16.28,8.36 5.97,31.11 35.89,18.08 36.55,18.85 26.85,23.57 12.95,20.7 18.08,18.97 34.54,27.64 37.64,28.02 28.63,4.78 30.23,6.25 32.41,5.05 44.88,27.38 40.56,25.48 52.93,15.77 52.93,14.63 54.51,15.54 56.74,16.87 6.86,0.69 35.61,4.75 29.59,11.23 22.35,10.29 48.97,23.77 50.22,18.82 44.81,29.57 46.48,27.41 54.64,27.91 48.23,23.77 46.48,26.8 55.45,26.8 55.45,27.91 35.86,24.03 62.03,27.69 30.58,9.37 30.2,12.45 27.89,27.13 8.15,13.28 18.01,17.4 10.08,2.44 45.24,12.17 46.41,12.17 47.65,12.19 20.57,17.42 26.75,15.27 55.68,6.58 31.9,31.7 37.03,29.13 45.24,10.97 23.6,18.44 34.65,16.13 56.74,15.39
  pour Top: 0,33.38 67.23,33.38 67.23,-0.13 0,-0.13
  pour Bottom: 0,33.4 67.26,33.4 67.26,-0.13 0,-0.13
  cutout Bottom: 1.14,4.85 1.14,10.92 9.17,10.92 9.17,4.85
  cutout Top: 1.14,4.85 1.14,10.92 9.17,10.92 9.17,4.85
GPIO0  (via drill 0.35)
  Top 0.203: IO0.3 48.29,29.71 47.58,29.71 46.53,30.75 45.21,30.75 44.55,30.09 IO0.1 41.88,28.89 v39.95,28.89
  Bottom 0.203: X8.25 42.65,25.26 42.65,28.01 Q6.3 40.86,28.01 39.98,28.89 v39.95,28.89
INT_CCS811  (via drill 0.35)
  Top 0.203: U3.3 7.51,8.03 7.67,8.03 8.23,8.59 v8.23,9.58 | v25.53,16.71 26.26,17.45 35,17.45 v35.59,16.87
  Bottom 0.203: v8.23,9.58 8.23,8.26 8.38,8.1 9.9,8.1 9.9,9.68 12.12,9.68 12.12,8.61 12.95,7.78 16.99,7.78 17.47,7.3 19.45,7.3 19.54,7.39 21.39,7.39 21.39,9.25 21.57,9.42 22.78,9.42 22.78,9.87 22.89,9.98 22.89,12.15 25.53,14.78 v25.53,16.71 | X8.23 40.63,21.22 40.49,21.08 40.49,17.2 40.4,17.11 37.61,17.11 37.36,16.87 v35.59,16.87
ISO_DIN  (via drill 0.35)
  Top 0.203: v45.44,26.67 44.7,25.94 44.7,25.32 44.61,25.24 44.61,24.36 42.44,24.36 41.87,24.92 41.87,22.78 41.53,22.44 39.8,22.44 39.7,22.55 37.59,22.55 37.59,22.69 37.47,22.81 37.47,24.34 35.86,25.95 31.78,25.95 31.78,24.93 31.51,24.66 29.88,24.66 OK1.4
  Bottom 0.203: X8.27 45.44,25.64 v45.44,26.67 45.44,27.2 45.77,27.53 45.14,28.17 R3.2
ISO_DIN_NEG
  Top 0.203: J9.1 31.88,28.85 TP16.TP 35.16,28.85 37.72,26.29 38.5,26.29 OK1.2 39.38,27.16 40.75,27.16 | SJ3.1 41.17,26.75 40.75,27.16 | 40.75,27.16 D5.A
ISO_DIN_POS
  Top 0.203: TP17.TP 29.58,28.98 J9.2 29.87,28.09 27.79,28.09 R19.2
N$1  (via drill 0.35)
  Top 0.305: 38.05,7.77 D13.A 37.57,5.44 v37.39,5.26
  Bottom 0.305: v37.39,5.26 43.51,5.26 R43.2
N$2
  Bottom 0.406: Q1.1 30.6,18.75 R1.1 30.82,18.97 R2.2
N$3  (via drill 0.35)
  Top 0.406: K1.8 28.44,13.97 v29.08,13.97
  Bottom 0.406: Q1.3 31.22,13.97 v29.08,13.97
  Bottom 0.61: v29.08,13.97 28.07,14.99 D2.A
N$4
  Top 0.406: 9.69,28.25 J2.2
  Top 0.61: 9.69,28.25 TP18.TP 8.84,24.68 D4.A
N$5
  Bottom 0.203: R4.1 22.52,19.79 R15.2 22.44,17.46 Q2.1
N$6
  Bottom 0.203: R17.2 32.03,10.3 R16.1 35.01,9.65 38.35,9.65 38.35,10.52 Q3.1
N$7  (via drill 0.35)
  Top 0.406: K2.8 17.34,14.94 17.7,15.31 17.7,15.7 v17.65,15.75
  Bottom 0.406: v17.65,15.75 20.39,15.75 | Q2.3 21.2,15.31 D1.A
  Bottom 0.61: D1.A 20.39,15.75
N$8  (via drill 0.35)
  Top 0.406: v39.75,13.84 39.21,13.84 K4.8
  Bottom 0.406: Q3.3 38.45,13.84 v39.75,13.84 39.75,14.91 D6.A
N$9
  Top 0.203: OK1.1 40.36,23.85 D5.C | OK1.1 37.97,23.22 | R19.1 27.33,25.02 27.69,25.02 27.79,25.12 31.32,25.12 31.32,26.41 36.05,26.41 OK1.1
N$13
  Top 0.203: R23.2 2.03,9.5 2.03,10.19 7.39,10.19 7.39,9.12 U3.5 U3.4
N$14  (via drill 0.35)
  Top 0.203: U3.8 4.55,7.85 4.04,7.34 R23.1 v3.17,6.1 | R24.1 12.8,7.49 11.48,7.49 v11.43,7.54
  Bottom 0.203: v11.43,7.54 11.43,7.44 12.06,7.44 12.06,3.45 5.84,3.45 5.84,6.1 v3.17,6.1
N$15
  Top 0.203: U3.1 7.38,6.71 7.54,6.71 8.56,7.72 10.18,7.72 10.18,6.48 | 10.18,6.48 10.18,6.45 | 15.44,8.65 R24.4 15.4,8.18 13.7,6.48 10.18,6.48
N$20
  Bottom 0.508: IC1.8 11.32,27.94 R8.2
N$21
  Bottom 0.203: R8.1 8.97,28.19 4.32,28.19 4.32,23.7 R10.1
  Bottom 0.406: C7.2 9.14,23.72 R9.2 7.54,23.7 R10.1
N$22
  Bottom 0.406: R11.2 11.25,24.61 IC1.5
N$23
  Bottom 0.203: IC1.1 15.63,26.63 R7.1
N$24
  Bottom 0.203: IC1.6 11.32,25.38 12.27,25.38 12.27,28.78 10.59,28.78 10.59,32.21 13.49,32.21 13.49,31.37 R12.2
N$25
  Bottom 0.203: R11.1 13.08,22.99 16.76,22.99 16.76,23.2 16.98,23.42 C3.1
N$45
  Bottom 0.203: Q5.1 20.33,11.97 15.64,11.97 R46.5
N$48
  Bottom 0.203: R46.2 11.02,10.14 11.02,12.03 4.01,12.03 4.01,14 3.07,14 3.07,21.05 3.88,21.05 3.88,22.64 3.38,22.64 3.38,27.91 4.5,29.03 10.16,29.03 10.16,22.13 19.97,22.13 19.97,24.73 19.78,24.73 19.53,24.99 19.53,27.84 27.14,27.84 27.14,25.75 31.53,25.75 31.53,28.31 35.38,28.31 35.38,30.37 37.26,30.37 37.26,30.36 39.97,30.36 Q6.1
NEOPIX  (via drill 0.35)
  Top 0.203: LED1.1 56.77,29.82 56.77,28.19 56.62,28.04 56.62,26.59 58.47,26.59 v58.52,26.64
  Bottom 0.203: X8.37 v58.52,26.64
PW_LED
  Bottom 0.305: R43.1 45.54,6.89 48.18,6.89 48.36,7.07 X8.10
R1OA
  Top 0.305: J1.1 24.61,28.03 TP6.TP 24.61,26.44 23.11,26.44 23.11,23.39 25.39,23.39 25.39,23.09 | K4.3 32.99,21.38
  Top 0.406: 25.39,23.09 25.39,22.64 25.74,22.64 25.74,20.05 28.81,20.05 30.14,21.38 30.14,22.61 32,22.61 32,21.38 K4.3
R1OB
  Top 0.305: J1.2 22.1,26.77 22.44,26.77 22.44,22.74 23.75,22.74 23.75,19.43 31.07,19.43 K4.4
  Top 0.406: J1.2 22.1,28.45 23.67,30.02 TP5.TP
R1OC  (via drill 0.35)
  Top 0.305: TP7.TP 15.85,4.5 16.98,4.5 16.98,4.17 | 16.86,4.17 J4.1
  Top 0.406: K4.6 33.27,11.84 25.43,11.84 v25.4,11.86 | v16.87,5.99 v16.86,5.98 16.86,4.17 16.98,4.17
  Bottom 0.406: v25.4,11.86 24.38,11.86 24.36,11.84 24.36,5.99 v16.87,5.99
R1OD  (via drill 0.35)
  Top 0.305: TP8.TP 17.7,1.45 17.7,4.73 J4.2
  Top 0.406: K4.5 31.07,13.11 25.1,13.11 v24.74,12.75 | v18.24,6.66 18.11,6.53 J4.2
  Bottom 0.406: v24.74,12.75 24.54,12.55 24.21,12.55 23.7,12.03 23.7,6.71 23.65,6.66 v18.24,6.66
R2OA
  Top 0.305: J1.3 20.85,26.19 21.79,26.19 21.79,22.22 K1.3
  Top 0.406: J1.3 21.13,28.31 21.13,29.34 21.77,29.97 TP4.TP
R2OB
  Top 0.305: J1.4 19.6,26.29 19.28,26.29 19.28,21.41 K1.4
  Top 0.406: J1.4 19.6,30.43 TP1.TP
R2OC
  Top 0.305: TP9.TP 19.23,4.73 J4.3
  Top 0.406: K1.6 22.61,15.95 19.41,15.95 19.41,4.73 J4.3
R2OD
  Top 0.305: TP12.TP 21.21,2.49 20.73,2.49 20.73,3.4 20.61,3.53 J4.4
  Top 0.406: K1.5 20.41,4.9 20.73,4.9 20.73,3.4
R3OA
  Top 0.305: K2.3 11.94,22.81 17.4,22.81 17.4,26.82 18.36,26.82 J1.5
  Top 0.406: J1.5 18.35,29.3 TP2.TP
R3OB
  Top 0.305: TP3.TP 15.98,23.45 9.74,23.45 K2.4
  Top 0.406: TP3.TP 16.73,28.03 J1.6
R3OC  (via drill 0.35)
  Top 0.305: TP11.TP 23.29,2.06 22.19,2.06 22.19,2.43 21.86,2.43 J4.5
  Top 0.406: J4.5 21.73,4.86 21.73,12.88 v21.64,12.88 | v17.35,12.8 16.74,12.19 11.94,12.19 K2.6
  Bottom 0.406: v17.35,12.8 17.45,12.7 18.8,12.7 19,12.9 21.62,12.9 v21.64,12.88
R3OD  (via drill 0.35)
  Top 0.305: TP10.TP 23.11,5.94 J4.6 | K2.5 10.92,13.25 10.92,11.56 17.53,11.56 17.53,8.48 15.8,6.76 v15.8,6.27
  Top 0.406: v27.05,5.21 26.58,4.73 J4.6
  Bottom 0.305: v15.8,6.27 16,6.07 16,5.21 v27.05,5.21
RELAY1
  Bottom 0.203: X8.24 33.93,22.49 33.93,13.18 28.83,13.18 28.83,7.29 34.39,7.29 34.39,8.6 R16.2
RELAY2
  Bottom 0.203: R1.2 32.4,19.71 31.65,19.71 31.65,23.32 32.77,23.32 32.77,24 35.05,24 35.05,23.22 44.58,23.16 44.58,25.26 X8.26
RELAY3
  Bottom 0.203: X8.14 43.26,8.24 43.26,6.83 26.04,6.83 26.04,17.78 25.01,18.81 25.01,21.18 R4.2
RESET  (via drill 0.35)
  Top 0.203: v57.25,9.58 56.79,10.03 55.73,10.03 50.93,14.83 50.93,23.93 50.52,24.33 47.55,24.33 47.37,24.51 47.18,24.71 47.18,27.97 46.82,28.32 39.09,28.32 38.61,28.8 39.42,29.61 40.7,29.61 RST.3 39.58,30.09 38.91,30.75 37.72,30.75 37.05,30.09 RST.1 33.94,30.09 33.86,30.01 32.37,30.01 v30.73,31.65 | v20.62,31.88 20.62,29.28 20.33,28.98 20.33,23.31 21.24,22.4 21.24,19.63 v24.66,16.2
  Bottom 0.203: 18.38,11.05 Q5.3 18.38,11.15 22.3,11.15 22.3,12.84 24.43,14.97 24.43,15.97 v24.66,16.2 | 18.38,11.05 18.38,8.4 C32.1 | R46.6 15.61,11.05 18.38,11.05 | X8.3 v57.25,9.58 | v30.73,31.65 27.62,31.65 27.21,32.06 23.62,32.06 23.01,31.46 21.04,31.46 v20.62,31.88
RST_CCS811  (via drill 0.35)
  Top 0.203: U3.2 7.38,7.31 7.54,7.31 8.07,7.83 8.3,8.06 10.73,8.06 v11.3,8.64 12.19,9.53 13.23,9.53 13.7,9.06 R24.2
  Bottom 0.203: X8.13 44.69,8.12 44.69,4.02 44.23,3.56 14.14,3.56 12.39,5.3 12.39,7.58 12.2,7.77 12.17,7.77 v11.3,8.64
RTS
  Bottom 0.203: IC4.19 16.36,15.07 16.36,13.93 14.81,12.37 14.81,10.14 R46.7 17.53,10.14 17.6,10.08 17.6,7.69 17.66,7.63 19.31,7.63 19.31,9.05 Q5.2
RXD0  (via drill 0.35)
  Top 0.203: v40.97,8.87 40.97,6.82 42.9,6.82 42.9,2.51 v42.88,2.49 | v12.65,2.49 12.52,2.62 12.52,3.76 12.65,3.76 | 12.65,3.76 12.65,3.86 v12.78,3.86 | v15.21,13.59 16.46,13.59 16.46,16.32 18.21,16.32 18.21,13.3 18.06,13.3 18.06,11.96 17.93,11.96 17.93,7.47 17.55,7.47 16.33,6.25 16.33,5.74 14.26,5.74 14.26,3.76 12.65,3.76
  Bottom 0.203: X8.34 54.71,24.23 50.9,24.23 50.9,22.07 43.31,22.07 43.31,9.65 40.97,9.65 v40.97,8.87 | v42.88,2.49 v12.65,2.49 | IC4.21 14.96,15.47 14.96,13.84 v15.21,13.59
SCL  (via drill 0.35)
  Top 0.203: U3.10 5.39,6.65 5.39,6.37 6.17,6.37 6.17,1.88 v10.69,1.88 | v60.07,2.54 60.07,27.33 v57.23,27.33
  Bottom 0.203: X8.36 57.33,25.26 57.33,27.33 v57.23,27.33 49.35,27.33 R14.2 | v10.69,1.88 11.2,1.37 60.07,1.37 v60.07,2.54
SDA  (via drill 0.35)
  Top 0.203: U3.9 5.12,7.19 4.64,7.19 4.64,5.99 5.82,5.99 5.82,1.52 9.78,1.52 10.16,1.14 v10.16,0.91 | v60.86,2.46 60.86,28.25 v58.24,28.25 | v53.47,26.62 v53.47,27.98
  Bottom 0.203: v58.24,28.25 58.47,28.47 58.47,29.22 54.71,29.22 v53.47,27.98 52.38,27.98 R13.2 | v10.16,0.91 41.56,0.91 60.86,0.91 v60.86,2.46 | X8.33 53.44,26.59 v53.47,26.62
SW
  Bottom 0.406: L1.1 18.05,24.38 C3.2
  Bottom 0.508: IC1.3 16.97,25.33 L1.1
TXD0  (via drill 0.35)
  Top 0.203: v43.46,2.01 43.46,7.44 41.66,7.44 41.66,8.79 v42.01,8.79 | v15.87,14.25 16.13,14.51 16.13,16.73 18.75,16.73 18.75,7.82 | 18.75,7.82 18.75,7.57 | 18.75,7.82 18.73,7.81 18.73,3.88 18.15,3.3 18.15,0.65 18.02,0.52 16.43,0.52 16.29,0.65 16.29,2.42 15.6,3.11 14.03,3.11 12.34,1.42 11.99,1.42 11.53,1.88 v11.53,2.39
  Bottom 0.203: IC4.20 15.41,14.25 v15.87,14.25 | v42.01,8.79 42.01,9.25 43.89,9.25 43.89,21.74 51.33,21.74 51.33,23.82 56.01,23.82 56.01,25.26 X8.35 | v43.46,2.01 43.31,1.85 11.53,1.85 v11.53,2.39
VBUS  (via drill 0.35)
  Top 0.203: v5.21,27.69 4.95,27.43 v4.95,22.61 | R18.2 31.28,6.81 U1.1
  Top 0.406: 17.34,21.02 K2.1 | v29.08,21.84 28.65,21.41 K1.1 | K4.1 38.53,21.38 38.43,21.38 37.8,21.38 v37.46,21.72 | 16.29,21.43 v16.26,21.46
  Top 0.61: v18.29,20.07 17.34,21.02 | 38.53,21.38 38.71,21.38 45.59,21.38 C1.1 44.32,22.62 43.7,23.24 42.9,23.24 v42.9,23.75 | K2.1 16.29,21.43 | v51.71,20.8 51.71,20.23 U2.1 52.49,17.66 R44.2 | U1.1 31.28,8.55 31.3,8.57 31.3,8.93 32.12,9.75 36.83,9.75 36.83,17.16 38.43,18.76 38.43,21.38 | v46.9,21.13 46.65,21.38 46.35,21.38 46.35,20.09 46.3,20.04 46.3,19.5 C9.+
  Top 0.813: 38.71,21.38 46.35,21.38
  Bottom 0.203: IC4.8 13.91,21.4 13.97,21.46 | R9.1 7.37,25.42 7.37,27.69 v5.21,27.69
  Bottom 0.406: X6.A4B9 7.22,15.18 6.69,15.18 6.34,15.54 4.33,15.54 4.01,15.85 4.01,18.59 4.39,18.97 4.95,18.97 | 4.95,18.97 5.8,18.97 6.82,20 7.21,20 X6.B4A9 | 29.08,21.47 v29.08,21.84 | R9.1 9.14,25.42 C7.1 | v4.95,22.61 4.95,18.97 | v16.26,21.46 14.48,21.46 | 20.4,26.36 L1.2 | v37.46,21.72 38.35,20.83 38.73,20.83 38.73,19.88 D6.C
  Bottom 0.61: v18.29,20.07 20.14,20.07 D1.C 20.57,26.19 20.4,26.36 | L1.2 20.45,26.96 C4.2 C5.2 25.68,26.96 25.68,20.41 26.84,19.25 D2.C 29.08,20.27 v29.08,21.84 29.08,22.94 29.46,22.94 29.46,23.95 32.16,23.95 32.16,26.6 37.63,26.6 R45.2 | 37.74,26.01 R45.2 | X6.B4A9 7.29,19.94 8.89,19.94 8.89,21.46 9.66,21.46 11.02,21.46 13.97,21.46 v16.26,21.46 | R45.2 40.79,26.49 42.01,25.27 42.01,23.98 42.24,23.75 v42.9,23.75 | v51.71,20.8 47.27,20.8 46.94,21.13 v46.9,21.13
VIN  (via drill 0.35)
  Top 0.203: v9.53,31.75 12.09,31.75 12.09,28.35 v13.89,28.35
  Top 0.61: D4.C 13.89,26.04 v13.89,28.35
  Bottom 0.203: R86.2 50.98,3.1 6.27,3.1 4.42,1.25 1.93,1.25 0.54,2.64 0.53,3.31 0.53,31.75 v9.53,31.75
  Bottom 0.508: IC1.2 12.95,25.98 12.95,28.55 12.95,29.16 R12.1 13.42,29.63 C6.2
  Bottom 0.61: v13.89,28.35 13.69,28.55 12.95,28.55
VIN_V
  Bottom 0.203: R86.1 51.49,5 52.7,5 | 52.7,5 R87.2 | D21.C 52.7,3.1 52.7,4.83 52.7,5 | X8.5 54.12,7.67 54.12,7.57 53.02,6.48 52.83,6.48 52.7,6.35 52.7,5
  Bottom 0.305: X8.5 54.28,7.84
WAKE_CCS811  (via drill 0.35)
  Top 0.203: R24.3 14.45,8.65 14.45,7.94 13.72,7.21 v13.49,7.21 13.23,6.96 10.95,6.96 v10.87,7.04 | v2.97,9.58 3.59,8.96 4.08,8.96 4.59,8.45 U3.7 | v30.25,7.82 30.25,7.29 29.16,6.2 29.16,4.72 v29.34,4.55
  Bottom 0.203: v10.87,7.04 11.51,6.4 11.51,3.79 6.17,3.79 6.17,8.91 3.89,8.91 3.23,9.58 v2.97,9.58 | v30.25,7.82 30.02,8.05 30.02,10.48 32.18,12.63 35.33,12.63 36.16,11.8 38.11,11.8 38.64,12.33 X8.16 | v29.34,4.55 28.85,4.06 16.36,4.06 13.49,6.93 v13.49,7.21

### Text on the board
tNames: v2.0
bNames: + | - | RST | GPIO0 | R3 | R2 | R1 | ISO_IN | R1 | R2 | R3 | - | + | 3v3 | IN1 | + | IN2 | + | IN3 | +
tValues: 6V-24V | G | G | P | G | P | G | P | IN2 | IN3 | IN1
bValues: ISOIN